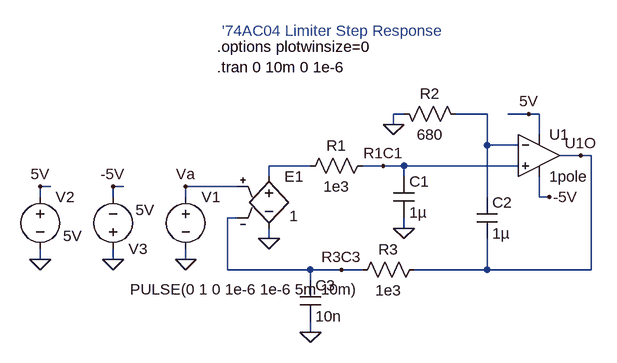
[diagram p0: schematic aclim04.asc]
aclim04.asc, the LTspice schematic file:
Version 4
SHEET 1 1260 864
WIRE -112 -16 -128 -16
WIRE 16 -16 -32 -16
WIRE 80 -16 48 -16
WIRE 96 -16 80 -16
WIRE -128 0 -128 -16
WIRE 96 16 96 -16
WIRE 16 32 16 -16
WIRE 64 32 16 32
WIRE 160 48 128 48
WIRE 176 48 160 48
WIRE -256 64 -320 64
WIRE -144 64 -176 64
WIRE -112 64 -144 64
WIRE 64 64 -112 64
WIRE -320 80 -320 64
WIRE -112 80 -112 64
WIRE -656 96 -672 96
WIRE -544 96 -560 96
WIRE -368 96 -448 96
WIRE -672 112 -672 96
WIRE -560 112 -560 96
WIRE -448 112 -448 96
WIRE 16 112 16 32
WIRE 96 112 96 80
WIRE 112 112 96 112
WIRE -368 144 -384 144
WIRE -112 160 -112 144
WIRE -320 176 -320 160
WIRE -672 208 -672 192
WIRE -560 208 -560 192
WIRE -448 208 -448 192
WIRE -384 224 -384 144
WIRE -256 224 -384 224
WIRE -208 224 -256 224
WIRE -176 224 -208 224
WIRE 16 224 16 176
WIRE 16 224 -96 224
WIRE 176 224 176 48
WIRE 176 224 16 224
WIRE -256 240 -256 224
WIRE -256 320 -256 304
FLAG -448 96 Va
FLAG -112 160 0
FLAG -144 64 R1C1
FLAG -320 176 0
FLAG -672 208 0
FLAG -672 96 5V
FLAG 80 -16 5V
FLAG 160 48 U1O
FLAG -560 208 0
FLAG -560 96 -5V
FLAG 112 112 -5V
FLAG -448 208 0
FLAG -256 320 0
FLAG -208 224 R3C3
FLAG -128 0 0
SYMBOL Voltage -448 96 R0
WINDOW 123 34 79 Left 0
WINDOW 39 0 0 Left 0
WINDOW 3 -86 158 Left 0
SYMATTR Value PULSE(0 1 0 1e-6 1e-6 5m 10m)
SYMATTR InstName V1
SYMBOL cap -128 80 R0
SYMATTR InstName C1
SYMATTR Value 1µ
SYMBOL res -272 80 R270
WINDOW 0 32 56 VTop 0
WINDOW 3 0 56 VBottom 0
SYMATTR InstName R1
SYMATTR Value 1e3
SYMBOL e -320 64 R0
WINDOW 3 32 77 Left 0
SYMATTR Value 1
SYMATTR InstName E1
SYMBOL Opamps\\1pole 96 48 R0
SYMATTR InstName U1
SYMBOL Voltage -672 96 R0
WINDOW 123 34 79 Left 0
WINDOW 39 0 0 Left 0
WINDOW 3 35 76 Left 0
SYMATTR Value 5V
SYMATTR InstName V2
SYMBOL res -128 -32 M90
WINDOW 0 0 56 VBottom 0
WINDOW 3 32 56 VTop 0
SYMATTR InstName R2
SYMATTR Value 680
SYMBOL cap 0 112 R0
SYMATTR InstName C2
SYMATTR Value 1µ
SYMBOL Voltage -560 208 M180
WINDOW 123 34 79 Left 0
WINDOW 39 0 0 Left 0
WINDOW 3 35 76 Left 0
SYMATTR Value 5V
SYMATTR InstName V3
SYMBOL res -192 240 R270
WINDOW 0 32 56 VTop 0
WINDOW 3 0 56 VBottom 0
SYMATTR InstName R3
SYMATTR Value 1e3
SYMBOL cap -272 240 R0
SYMATTR InstName C3
SYMATTR Value 10n
TEXT -392 -144 Left 0 ;'74AC04 Limiter Step Response
TEXT -400 -88 Left 0 !.tran 0 10m 0 1e-6
TEXT -400 -120 Left 0 !.options plotwinsize=0

The netlist it stands for:
* aclim04.asc
V1 Va 0 PULSE(0 1 0 1e-6 1e-6 5m 10m)
C1 R1C1 0 1µ
R1 N002 R1C1 1e3
E1 N002 0 Va R3C3 1
* U1: 1pole (symbol Opamps\1pole not available, pins judged from their places): In+=R1C1 In-=N001 V+=5V V-=-5V OUT=U1O
V2 5V 0 5V
R2 0 N001 680
C2 N001 U1O 1µ
V3 0 -5V 5V
R3 R3C3 U1O 1e3
C3 R3C3 0 10n
* '74AC04 Limiter Step Response
.tran 0 10m 0 1e-6
.options plotwinsize=0
.backanno
.end